# EAGLE design boost_gauge (EAGLE 7.3.0)
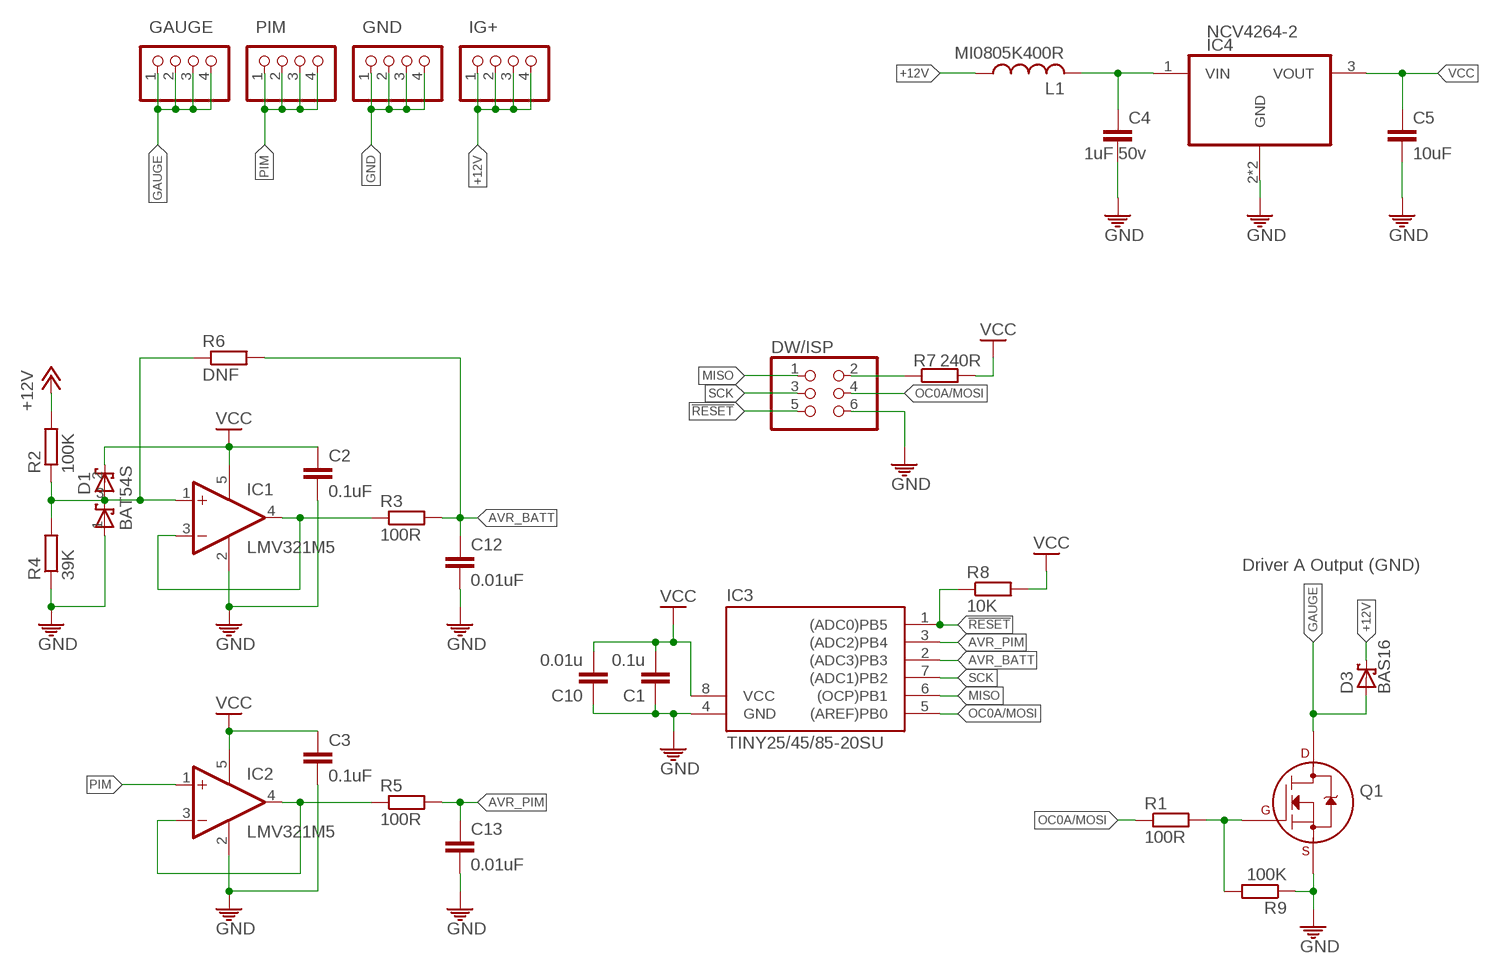
[diagram p0: schematic, sheet 1]

## Parts
C1  0.1u  C-EUC0603  [C0603]
C2  0.1uF  C-EUC0603  [C0603]
C3  0.1uF  C-EUC0603  [C0603]
C4  1uF 50v  C-EUC0603  [C0603]
C5  10uF  C-EUC1206  [C1206]
C10  0.01u  C-EUC0603  [C0603]
C12  0.01uF  C-EUC0603  [C0603]
C13  0.01uF  C-EUC0603  [C0603]
D1  BAT54S  [SOT23]
D3  BAS16  [SOT23]
DW/ISP  PINHD-2X3  [2X03]
GAUGE  PCB-2  [PCB-2]
GND  PCB-2  [PCB-2]
IC1  LMV321M5  [SOT23-5]
IC2  LMV321M5  [SOT23-5]
IC3  TINY25/45/85-20SU  [SOIC8]
IC4  NCV4264-2  [SOT223]
IG+  PCB-2  [PCB-2]
L1  MI0805K400R  [R0805]
PIM  PCB-2  [PCB-2]
Q1  2N7002A  [SOT23]
R1  100R  R-EU_R0603  [R0603]
R2  100K  R-EU_R0603  [R0603]
R3  100R  R-EU_R0603  [R0603]
R4  39K  R-EU_R0603  [R0603]
R5  100R  R-EU_R0603  [R0603]
R6  DNF  R-EU_R0603  [R0603]
R7  240R  R-EU_R0603  [R0603]
R8  10K  R-EU_R0603  [R0603]
R9  100K  R-EU_R0603  [R0603]

## Nets
!RESET: DW/ISP.5 IC3.1((ADC0)PB5) R8.1
+12V: D3.3(C) IG+.1 IG+.2 IG+.3 IG+.4 L1.1 R2.2
AVR_BATT: C12.1 IC3.2((ADC3)PB3) R3.2 R6.2
AVR_PIM: C13.1 IC3.3((ADC2)PB4) R5.2
GAUGE: D3.1(A) GAUGE.1 GAUGE.2 GAUGE.3 GAUGE.4 Q1.3(D)
GND: C1.1 C2.2 C3.2 C4.2 C5.2 C10.1 C12.2 C13.2 D1.1(A1) DW/ISP.6 GND.1 GND.2 GND.3 GND.4 IC1.2(V-) IC2.2(V-) IC3.4(GND) IC4.2(GND) IC4.4(GND) Q1.2(S) R4.1 R9.1
MISO: DW/ISP.1 IC3.6((OCP)PB1)
N$1: IC1.3(-IN) IC1.4(OUT) R3.1
N$2: D1.3(C1A2) IC1.1(+IN) R2.1 R4.2 R6.1
N$3: IC2.3(-IN) IC2.4(OUT) R5.1
N$4: C4.1 IC4.1(VIN) L1.2
N$5: Q1.1(G) R1.2 R9.2
N$7: DW/ISP.2 R7.1
OC0A/MOSI: DW/ISP.4 IC3.5((AREF)PB0) R1.1
PIM: IC2.1(+IN) PIM.1 PIM.2 PIM.3 PIM.4
SCK: DW/ISP.3 IC3.7((ADC1)PB2)
VCC: C1.2 C2.1 C3.1 C5.1 C10.2 D1.2(C2) IC1.5(V+) IC2.5(V+) IC3.8(VCC) IC4.3(VOUT) R7.2 R8.2

## Notes on the sheet
- Driver A Output (GND)

## Library data of the parts
C1-C5 C10 C12 C13 = toyotune:C-EU: CAPACITOR, European symbol
D1 = toyotune:BAT54S: Schottky Diodes Source: Fairchild .. BAT54.pdf
D3 = toyotune:BAS16: Silicon Schottky Diodes General-purpose diode for high-speed switching
DW/ISP = toyotune:PINHD-2X3: PIN HEADER
GAUGE GND IG+ PIM = toyotune:PCB-2
IC1 IC2 = linear:LMV321?*: General Purpose, Low Voltage, Rail-to-Rail Output Operational Amplifiers Source: http://www.national.com/mpf/LM/LMV321.html http://www.national.com/dt/lmv_qual.pdf
IC3 = avr-7:TINY25/45/85
IC4 = toyotune:NCV4264-2
L1 = toyotune:MI0805K400R
Q1 = transistors:2N700*: 2N7000, 2N7002, NDS7002A N-channel enhancement mode MOSFET
R1-R9 = toyotune:R-EU_: RESISTOR, European symbol

## Board
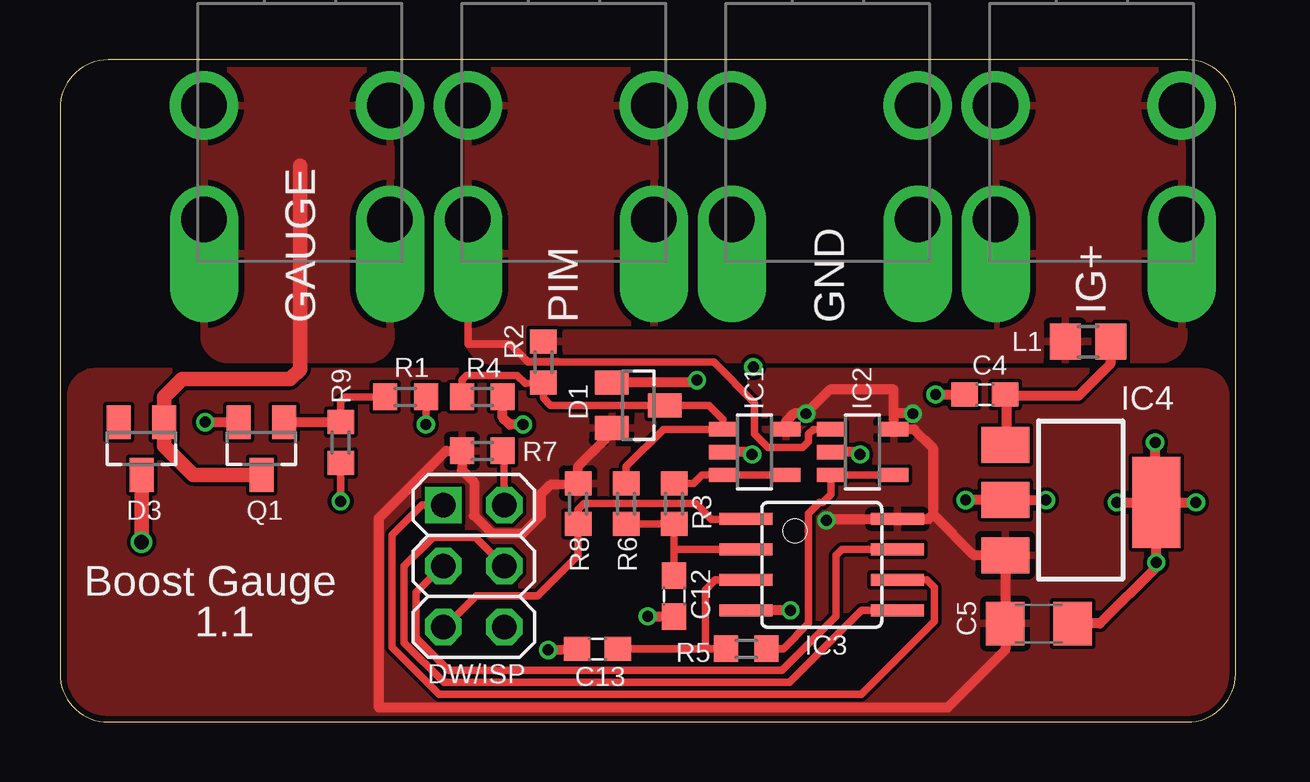
[diagram p1: board, top side]
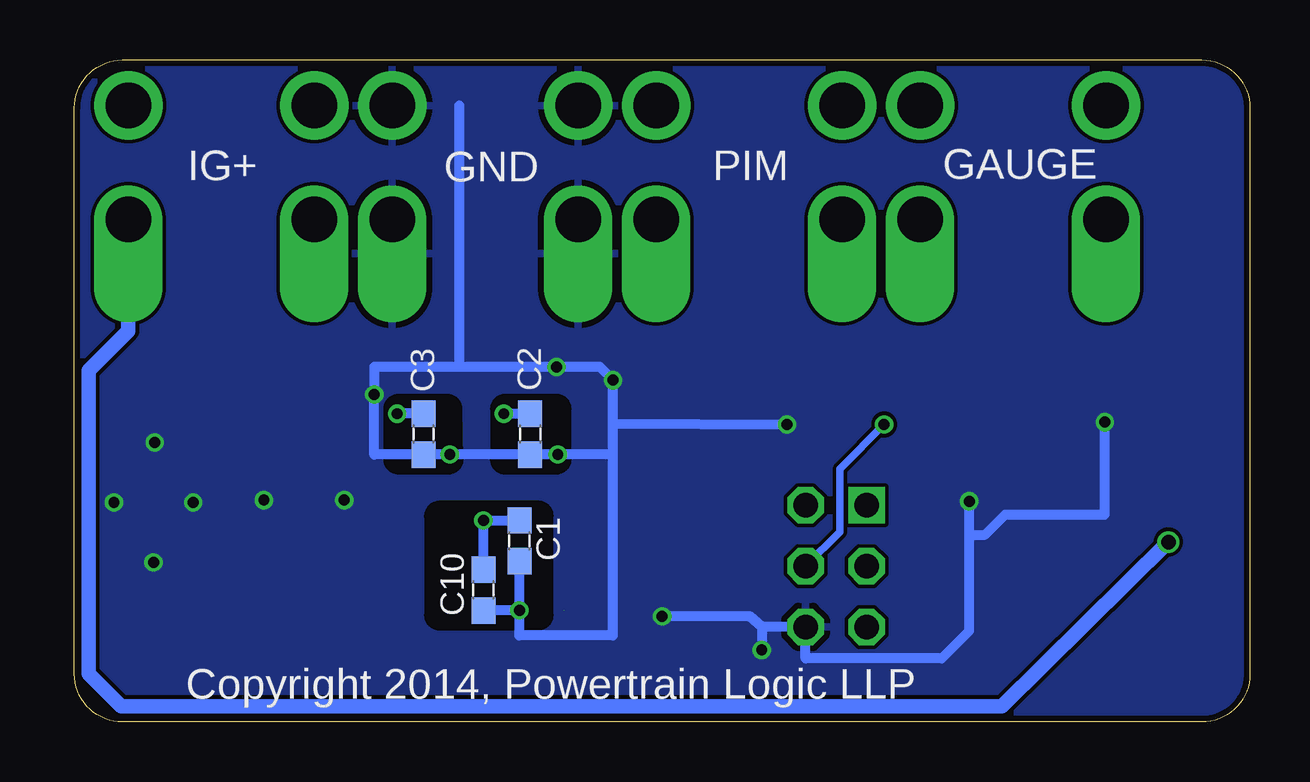
[diagram p2: board, bottom side, seen from below]

Size 49 x 27.6 mm. Coordinates in mm from the lower left corner, seen from the top.
Outline: 2,27.6 arc90 0,25.6 0,2 arc90 2,0 47,0 arc90 49,2 49,25.6 arc90 47,27.6 2,27.6
Copper layers (1*16): Top 0.035mm / dielectric 1.5mm / Bottom 0.035mm
Design rules "Fusion_eagle_rule_v1.1 *": minimum track width 6mil, minimum drill 12mil, track to track 6mil, track to pad 6mil, pad to pad 6mil, via to via 6mil, smd to smd 0mil, copper to edge 10mil, drill to drill 10mil, minimum pad ring 10mil, minimum via ring 6mil, stop-mask expansion 2mil, vias tented up to drill 100mil, thermal gap 10mil
bRestrict: area 29.1,4 to 34.3,9.1; area 28.4,10.4 to 31.6,13.6; area 32.9,10.4 to 36,13.6

### Footprints (pad centres in the part's own frame; a part is rotated, then mirrored left to right if it is on the bottom)
C0603 = smd 1.1 x 1: 1 -0.85,0; 2 0.85,0
C1206 = smd 1.6 x 1.8: 1 -1.4,0; 2 1.4,0
SOT23 = smd 1 x 1.4: 1 -0.95,-1.1; 2 0.95,-1.1; 3 0,1.1
2X03 = drill 1.016 square: 1 -2.54,-1.27 | drill 1.016 octagon: 2 -2.54,1.27; 3 0,-1.27; 4 0,1.27; 5 2.54,-1.27; 6 2.54,1.27
PCB-2 = drill 1.9: 1 -2.5,3.75; 3 -2.5,-4 | drill 1.9 offset: 2 2.25,3.75; 4 2.25,-4
SOT23-5 = smd 0.6 x 1.2: 1 -0.95,-1.306; 2 0,-1.306; 3 0.95,-1.306; 4 0.95,1.306; 5 -0.95,1.306
SOIC8 = smd 0.5 x 2.2: 1 -1.905,-3.154; 2 -0.645,-3.154; 3 0.625,-3.154; 4 1.895,-3.154; 5 1.905,3.154; 6 0.635,3.154; 7 -0.635,3.154; 8 -1.905,3.154
SOT223 = smd 1.5 x 2: 1 -2.4,-3; 2 -0.1,-3; 3 2.2,-3 | smd 3.8 x 2: 4 0,3.299
R0805 = smd 1.3 x 1.5: 1 -0.95,0; 2 0.95,0
R0603 = smd 1 x 1.1: 1 -0.85,0; 2 0.85,0

### Placement (x,y rotation side)
C1  30.45,7.55 90 bottom
C2  30,12 270 bottom
C3  34.45,12 270 bottom
C4  38.55,13.65 180 top
C5  40.8,4.1 0 top
C10  31.95,5.5 90 bottom
C12  25.6,5.25 270 top
C13  22.4,3.05 180 top
D1  24.1,13.2 270 top
D3  3.4,11.4 180 top
DW/ISP  17.25,6.5 270 top
GAUGE  10,23.2 270 top
GND  32,23.2 270 top
IC1  28.95,11.25 270 top
IC2  33.45,11.25 270 top
IC3  31.75,6.55 270 top
IC4  42.4,9.15 270 top
IG+  43,23.2 270 top
L1  42.85,15.85 0 top
PIM  21,23.2 270 top
Q1  8.4,11.4 180 top
R1  14.4,13.55 180 top
R2  20.15,15 90 top
R3  25.6,9.1 270 top
R4  17.6,13.55 180 top
R5  28.6,3.05 180 top
R6  23.6,9.1 270 top
R7  17.6,11.3 180 top
R8  21.6,9.1 90 top
R9  11.7,11.65 90 top

### Tracks (layer width: path | path; a pad name or v marks a point on that pad's centre or on a via)
!RESET
  Top 0.305: DW/ISP.5 16.05,3.96 17.35,5.26 17.35,5.25 19.9,5.25 21.6,6.95 R8.1 21.6,8.85 21.85,9.1 26.5,9.1 27.15,8.45 IC3.1
+12V  (via drill 0.6)
  Top 0.61: v3.4,7.5 D3.3
  Bottom 0.61: v3.4,7.5 10.35,0.65 47.05,0.65 48.4,2 48.4,14.65 46.75,16.3 IG+.2
  pour Top (rank 2): 46.84,16.11 arc-90 45.84,15.1 40.09,15.1 arc-90 39.09,16.1 39.01,26.14 arc-91 40.01,27.15 45.76,27.15 arc-89 46.76,26.16
  pour Top: 20.55,16.2 40.05,16.2 40.05,15.1 20.55,15.1
AVR_BATT
  Top 0.305: R6.2 R3.2 25.6,7.2 | C12.1 25.6,7.2 | IC3.2 25.61,7.19 25.6,7.2
AVR_PIM
  Top 0.305: 26.9,3.2 26.9,5.51 27.31,5.92 IC3.3 | 27.65,3.05 27.05,3.05 26.9,3.2 | C13.1 26.75,3.05 26.9,3.2
  Top 0.406: 27.65,3.05 R5.2
GAUGE
  Top 0.61: Q1.3 5.55,10.3 4.35,11.5 D3.1 4.35,13.55 5.1,14.3 9.6,14.3 10,14.7 10,23.2
  pour Top (rank 2): 12.8,15.1 arc90 13.8,16.1 13.8,26.15 arc90 12.8,27.15 7,27.15 arc90 6,26.15 6,16.15 arc90 7,15.1
GND  (via drill 0.46, 0.46 pad 0.3, 0.46 pad 0.41)  (1 unrouted)
  Top 0.305: v11.7,9.2 R9.1
  Top 0.406: v30.45,4.65 28.59,4.65 | v36.5,13.65 C4.2 | v19.3,12.4 18.75,12.4 18.45,12.7 R4.1 | v20.35,3 C13.2 | v24.5,4.4 C12.2 | v28.85,11.15 28.75,11.25 IC1.2 | v33.35,11.15 33.25,11.25 IC2.2 | D1.1 26.45,14.15 v26.55,14.25 | v6.05,12.5 Q1.2 | v37.75,9.25 IC4.2 v41.1,9.25 | v44.05,9.15 45.65,9.15 | 45.65,9.15 IC4.4 v47.35,9.15 | 45.65,9.15 45.7,9.1 v45.7,6.65 45.7,6.45 43.35,4.1 C5.2 | 45.65,9.15 v45.65,11.65
  Bottom 0.406: 32.95,14.8 v28.9,14.8 27.1,14.8 v26.55,14.25 26.55,12.45 | 20.35,3.96 DW/ISP.6 18.52,2.65 12.85,2.65 11.7,3.8 11.7,7.8 | 20.35,3.96 20.85,4.41 v24.5,4.4 | 11.7,7.8 v11.7,9.2 | v6.05,12.5 6.05,8.65 10.2,8.65 11.05,7.8 11.7,7.8 | 32.95,14.8 32.95,25.7 | 26.55,12.45 v19.3,12.4 | 20.35,3.96 v20.35,3 | v30.45,4.65 C1.1 | v30.45,4.65 C10.1 | v30.45,4.65 30.45,3.6 26.55,3.6 26.55,11.15 | 26.55,11.15 v28.85,11.15 C2.2 v33.35,11.15 C3.2 36.5,11.15 v36.5,13.65 36.5,14.8 32.95,14.8 | 26.55,11.15 26.55,12.45
  pour Bottom: -2.25,27.9 51.95,27.9 51.95,-0.75 -2.25,-0.75
MISO
  Top 0.305: DW/ISP.1 15.1,9.04 13.85,7.79 13.85,3.1 15.8,1.15 33.4,1.15 36.45,4.2 36.45,5.6 36.13,5.92 IC3.6
N$1
  Top 0.305: IC1.4 IC1.3 26.75,10.3 26.4,9.95 R3.1
N$2
  Top 0.305: R4.2 16.75,14.25 16.95,14.45 19.05,14.45 19.4,14.1 R2.1 20.15,13.5 20.45,13.2 D1.3 27.05,13.2 27.64,12.61 IC1.1 25.15,12.2 23.6,10.65 R6.1
N$3
  Top 0.305: IC2.4 IC2.3 32.14,9.49 31.8,9.15 31.65,9.15 31.2,8.7 31.2,4.1 30.15,3.05 R5.1
N$4
  Top 0.406: L1.2 43.8,14.95 42.46,13.61 39.44,13.61 | 39.44,13.61 C4.1 | 39.44,13.61 39.44,11.59 IC4.1
N$5
  Top 0.305: R1.2 11.9,13.55 11.7,13.35 R9.2
  Top 0.406: Q1.1 R9.2
N$7
  Top 0.305: DW/ISP.2 18.52,11.3 R7.1
OC0A/MOSI  (via drill 0.46 pad 0.3)
  Top 0.305: v15.25,12.4 R1.1 | DW/ISP.4 17.32,7.7 15.55,7.7 14.35,6.5 14.35,3.3 16,1.65 30.42,1.65 33.41,4.64 IC3.5
  Bottom 0.305: v15.25,12.4 17.1,10.55 17.1,7.92 DW/ISP.4
PIM
  Top 0.305: IC2.1 31.4,12.2 31.2,12 31.2,11.7 30.95,11.45 29.5,11.45 28.95,12 28.95,13.3 27.25,15 19.5,15 18.75,15.75 17,15.75 PIM.4
  pour Top (rank 2): 23.8,15.05 arc90 24.8,16.05 24.8,26.15 arc90 23.8,27.15 18,27.15 arc90 17,26.15 17,16.1 arc90 18,15.05
SCK
  Top 0.305: DW/ISP.3 15.95,6.5 14.85,5.4 14.85,3.5 16.2,2.15 30.1,2.15 32.35,4.4 32.35,6.95 32.59,7.18 IC3.7
VCC  (via drill 0.46)
  Top 0.406: R7.2 16.1,11.3 13.3,8.5 13.3,0.6 37,0.6 39.4,3 C5.1 IC4.3 38.1,6.95 36.4,8.65 | R7.2 16.65,11.4 | R7.2 16.75,10.5 17.25,10 17.25,8.6 18,7.85 19.3,7.85 20.05,8.6 20.05,9.5 20.45,9.9 R8.2 21.6,10.65 23.2,12.25 D1.2 | IC1.5 30.26,12.51 30.6,12.85 v31.1,12.85 32.1,13.85 34.76,13.85 IC2.5 35.6,12.2 36.4,11.4 36.4,8.65 | v35.55,12.85 34.75,12.85 | v31.95,8.4 32.01,8.45 IC3.8 36.2,8.45 36.4,8.65
  Bottom 0.406: C1.2 v31.95,8.4 C10.2 | v31.1,12.85 C2.1 | C3.1 v35.55,12.85
  pour Top: 48.6,0.15 0.45,0.15 0.45,13.6 arc-90 1.45,14.6 47.6,14.6 arc-90 48.6,13.6

### Text on the board
tPlace: GAUGE | PIM | GND | IG+ | Boost Gauge | 1.1
bPlace: Copyright 2014, Powertrain Logic LLP